# Altium schematic sheet Hardwareübersicht.SchDoc: Übersicht Prototyp Sensorknoten
size A4; Author: Daniel Frei; Organization: Technik und Informatik; Address1: Quellgasse 21; Address2: 2501 Biel/Bienne; Address3: Switzerland; Revision: 1.0; SheetNumber: 1; SheetTotal: 4; ProjectName: Rock Monitoring
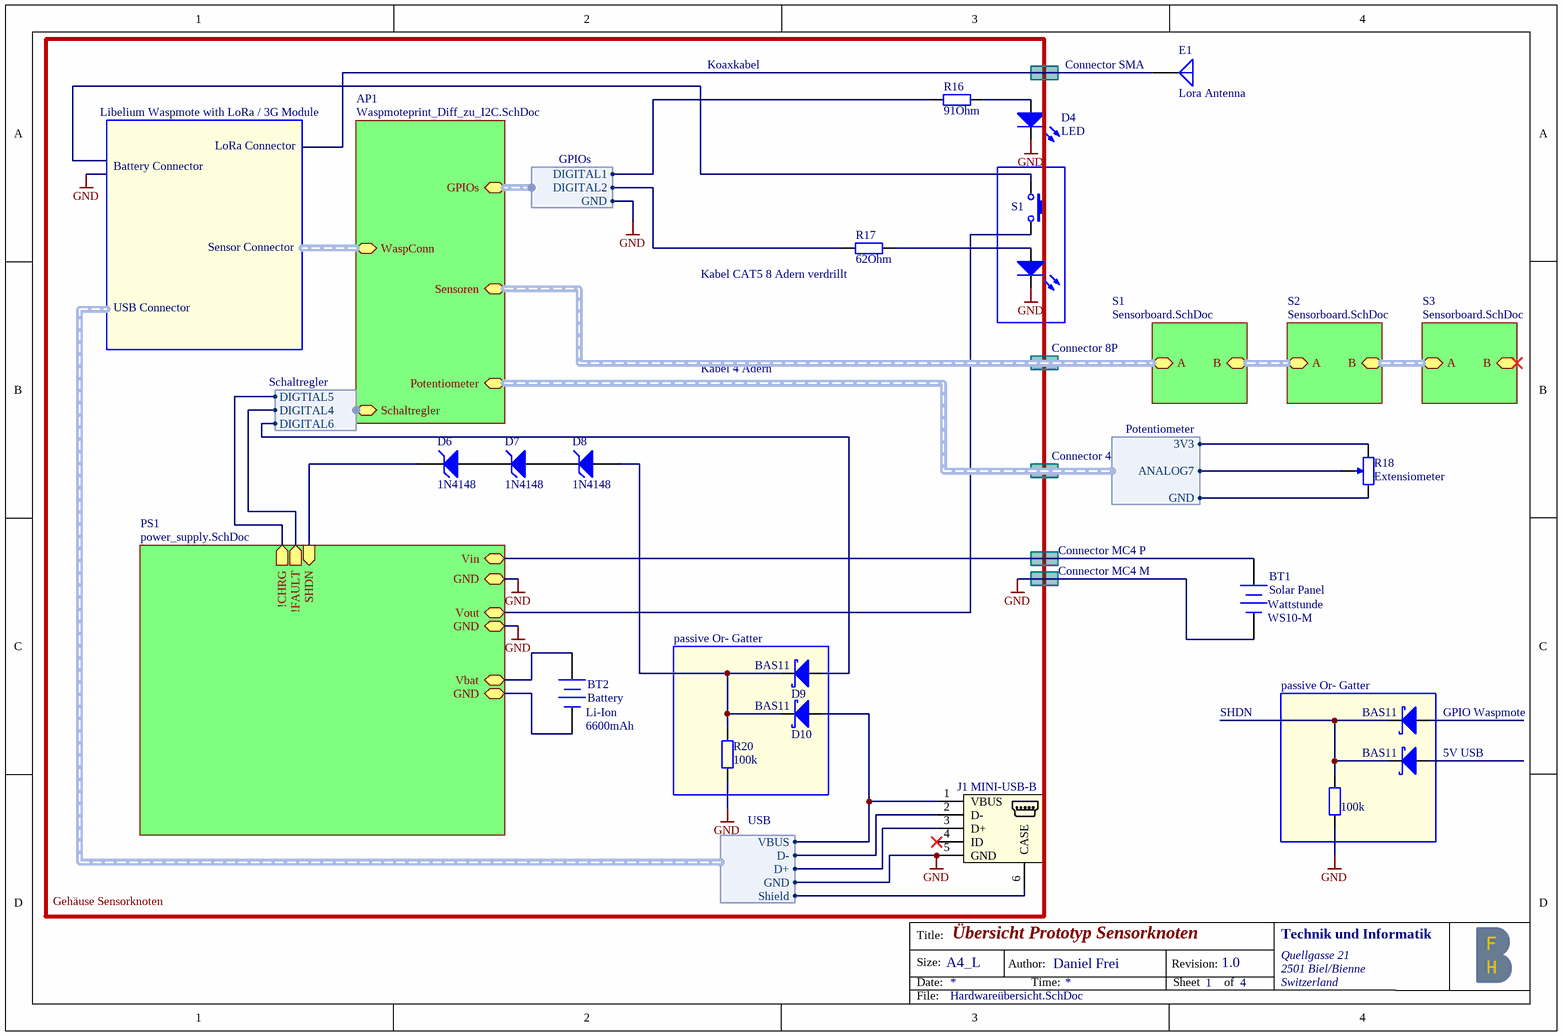
[diagram p0: Hardwareübersicht.SchDoc]

## Parts
BT1  Solar Panel  value WS10-M  Manufacturer: Wattstunde  [BAT-2]
BT2  Battery  Type: Li-Ion  Nom. Capacity: 6600mAh
D4  LED
D5  LED  (value not drawn)
D6  1N4148
D7  1N4148
D8  1N4148
D9  BAS11
D10  BAS11
D11  BAS11
D12  BAS11
E1  Lora Antenna  [PIN1]
J1  MINI-USB-B
R16  91Ohm  [RESC1005[0402]X35]
R17  62Ohm  [RESC1005[0402]X35]
R18  Extensiometer  [BOURNS3296W]
R20  100k  [RESC1608[0603]X50]
R21  100k  [RESC1608[0603]X50]
S1  Switch  (value not drawn)

## Blocks framed on the sheet
passive Or- Gatter: D9 D10 R20
passive Or- Gatter: D11 D12 R21

## Sub-sheets
AP1 = Waspmoteprint_Diff_zu_I2C.SchDoc: GPIOs (harness GPIOs), Potentiometer (harness Potentiometer), Schaltregler (harness Schaltregler), Sensoren (harness Sensoren), WaspConn (harness WaspmoteConnector)
PS1 = power_supply.SchDoc: SHDN (in), !CHRG (out), !FAULT (out), Vin (bidir), GND (bidir), GND (bidir), Vout (bidir), GND (bidir), Vbat (bidir)
S1 = Sensorboard.SchDoc: A (harness Sensoren), B (harness Sensoren)
S2 = Sensorboard.SchDoc: A (harness Sensoren), B (harness Sensoren)
S3 = Sensorboard.SchDoc: A (harness Sensoren), B (harness Sensoren)

## Harnesses
USB: VBUS, D-, D+, GND, Shield
Potentiometer: 3V3, ANALOG7, GND
Schaltregler: DIGITAL6, DIGITAL4, DIGTIAL5
GPIOs: DIGITAL1, DIGITAL2, GND

## Nets
GND: BT1.2(-) D4.2(K) D5.2(K) J1.5(GND) R20.1 R21.1 ; sheet PS1/GND, sheet PS1/GND, harness USB.GND, sheet AP1/GPIOs.GND
NetBT1_1: BT1.1(+) ; sheet PS1/Vin
NetBT2_1: BT2.1(+) ; sheet PS1/Vbat
NetBT2_2: BT2.2(-) ; sheet PS1/GND
NetD4_1: D4.1(A) R16.2
NetD5_1: D5.1(A) R17.2
NetD6_1: D6.1(A) D7.2(K)
NetD6_2: D6.2(K) ; sheet PS1/SHDN
NetD7_1: D7.1(A) D8.2(K)
NetD8_1: D8.1(A) D9.1(K) D10.1(K) R20.2
NetD9_2: D9.2(A) ; sheet AP1/Schaltregler.DIGITAL6
NetD10_2: D10.2(A) J1.1(VBUS) ; harness USB.VBUS
NetD11_1: D11.1(K) D12.1(K) R21.2
NetJ1_2: J1.2(D-) ; harness USB.D-
NetJ1_3: J1.3(D+) ; harness USB.D+
NetJ1_6: J1.6(CASE) ; harness USB.Shield
NetR16_1: R16.1 ; sheet AP1/GPIOs.DIGITAL1
NetR17_1: R17.1 ; sheet AP1/GPIOs.DIGITAL2
NetR18_1: R18.1(CCW) ; sheet AP1/Potentiometer.GND
NetR18_2: R18.2(Wiper) ; sheet AP1/Potentiometer.ANALOG7
NetR18_3: R18.3(CW) ; sheet AP1/Potentiometer.3V3
NetS1_1: S1.1 ; sheet PS1/Vout
(unnamed): sheet PS1/!CHRG, sheet AP1/Schaltregler.DIGTIAL5
(unnamed): sheet PS1/!FAULT, sheet AP1/Schaltregler.DIGITAL4

Not connected (* = marked no-connect by the designer): D11 2(A); D12 2(A); E1 1(A); J1 4(ID)*; S1 2

## Buses and harness runs
harness sheet AP1/Sensoren = sheet S1/A
harness sheet S1/B = sheet S2/A
harness sheet S2/B = sheet S3/A

## Notes on the sheet
- Libelium Waspmote with LoRa / 3G Module
- Koaxkabel
- Connector SMA
- Battery Connector
- LoRa Connector
- Sensor Connector
- USB Connector
- (near R17) Kabel CAT5 8 Adern verdrillt
- Kabel 4 Adern
- Connector 8P
- Connector 4P
- Connector MC4 P
- Connector MC4 M
- SHDN
- (near D11) GPIO Waspmote
- 5V USB
- Gehäuse Sensorknoten
- Title:
- Size:
- Date:
- A4_L
- Author:
- Time:
- Revision:
- Sheet
- of
- File:

## Library data of the parts
BT1 = Battery: Multicell Battery
BT2 = Battery: Nom. Voltage: 3.7V; Value: ICR18650H-1S3P
D4 = LED: Light Emitting Diode; Manufacturer: Dialight; Manufacturer Part. Nr.: 6071212310F; Color: green
D5 = LED: Light Emitting Diode; Color: green
D6-D8 = D Zener: Zener Diode
D9-D12 = D_SCHOTTKY: Schottky Diode; Value: BAS11
E1 = Antenna: Generic Antenna; Published: 24-Mar-1999; LatestRevisionDate: 17-Jul-2002; LatestRevisionNote: Re-released for DXP Platform.; PackageReference: PIN1; Publisher: Altium Limited
J1 = TYCO_1734035_1: Mini USB B Connector; Manufacturer Part. Nr.: 17-250021; Manufacturer: Conec
R16 R17 = R: Resistor; Modified_by: BEP1; Modified: 10.2008
R18 = POT2: Variable Resistor
R20 R21 = R: Resistor THT
S1 = SW_SPST_PB: Switch with Led; Manufacturer Part. Nr.: RP8200B2M1CEBLKBLKRED; Manufacturer: E-Switch